# EAGLE schematic testv1 (EAGLE 6.3)
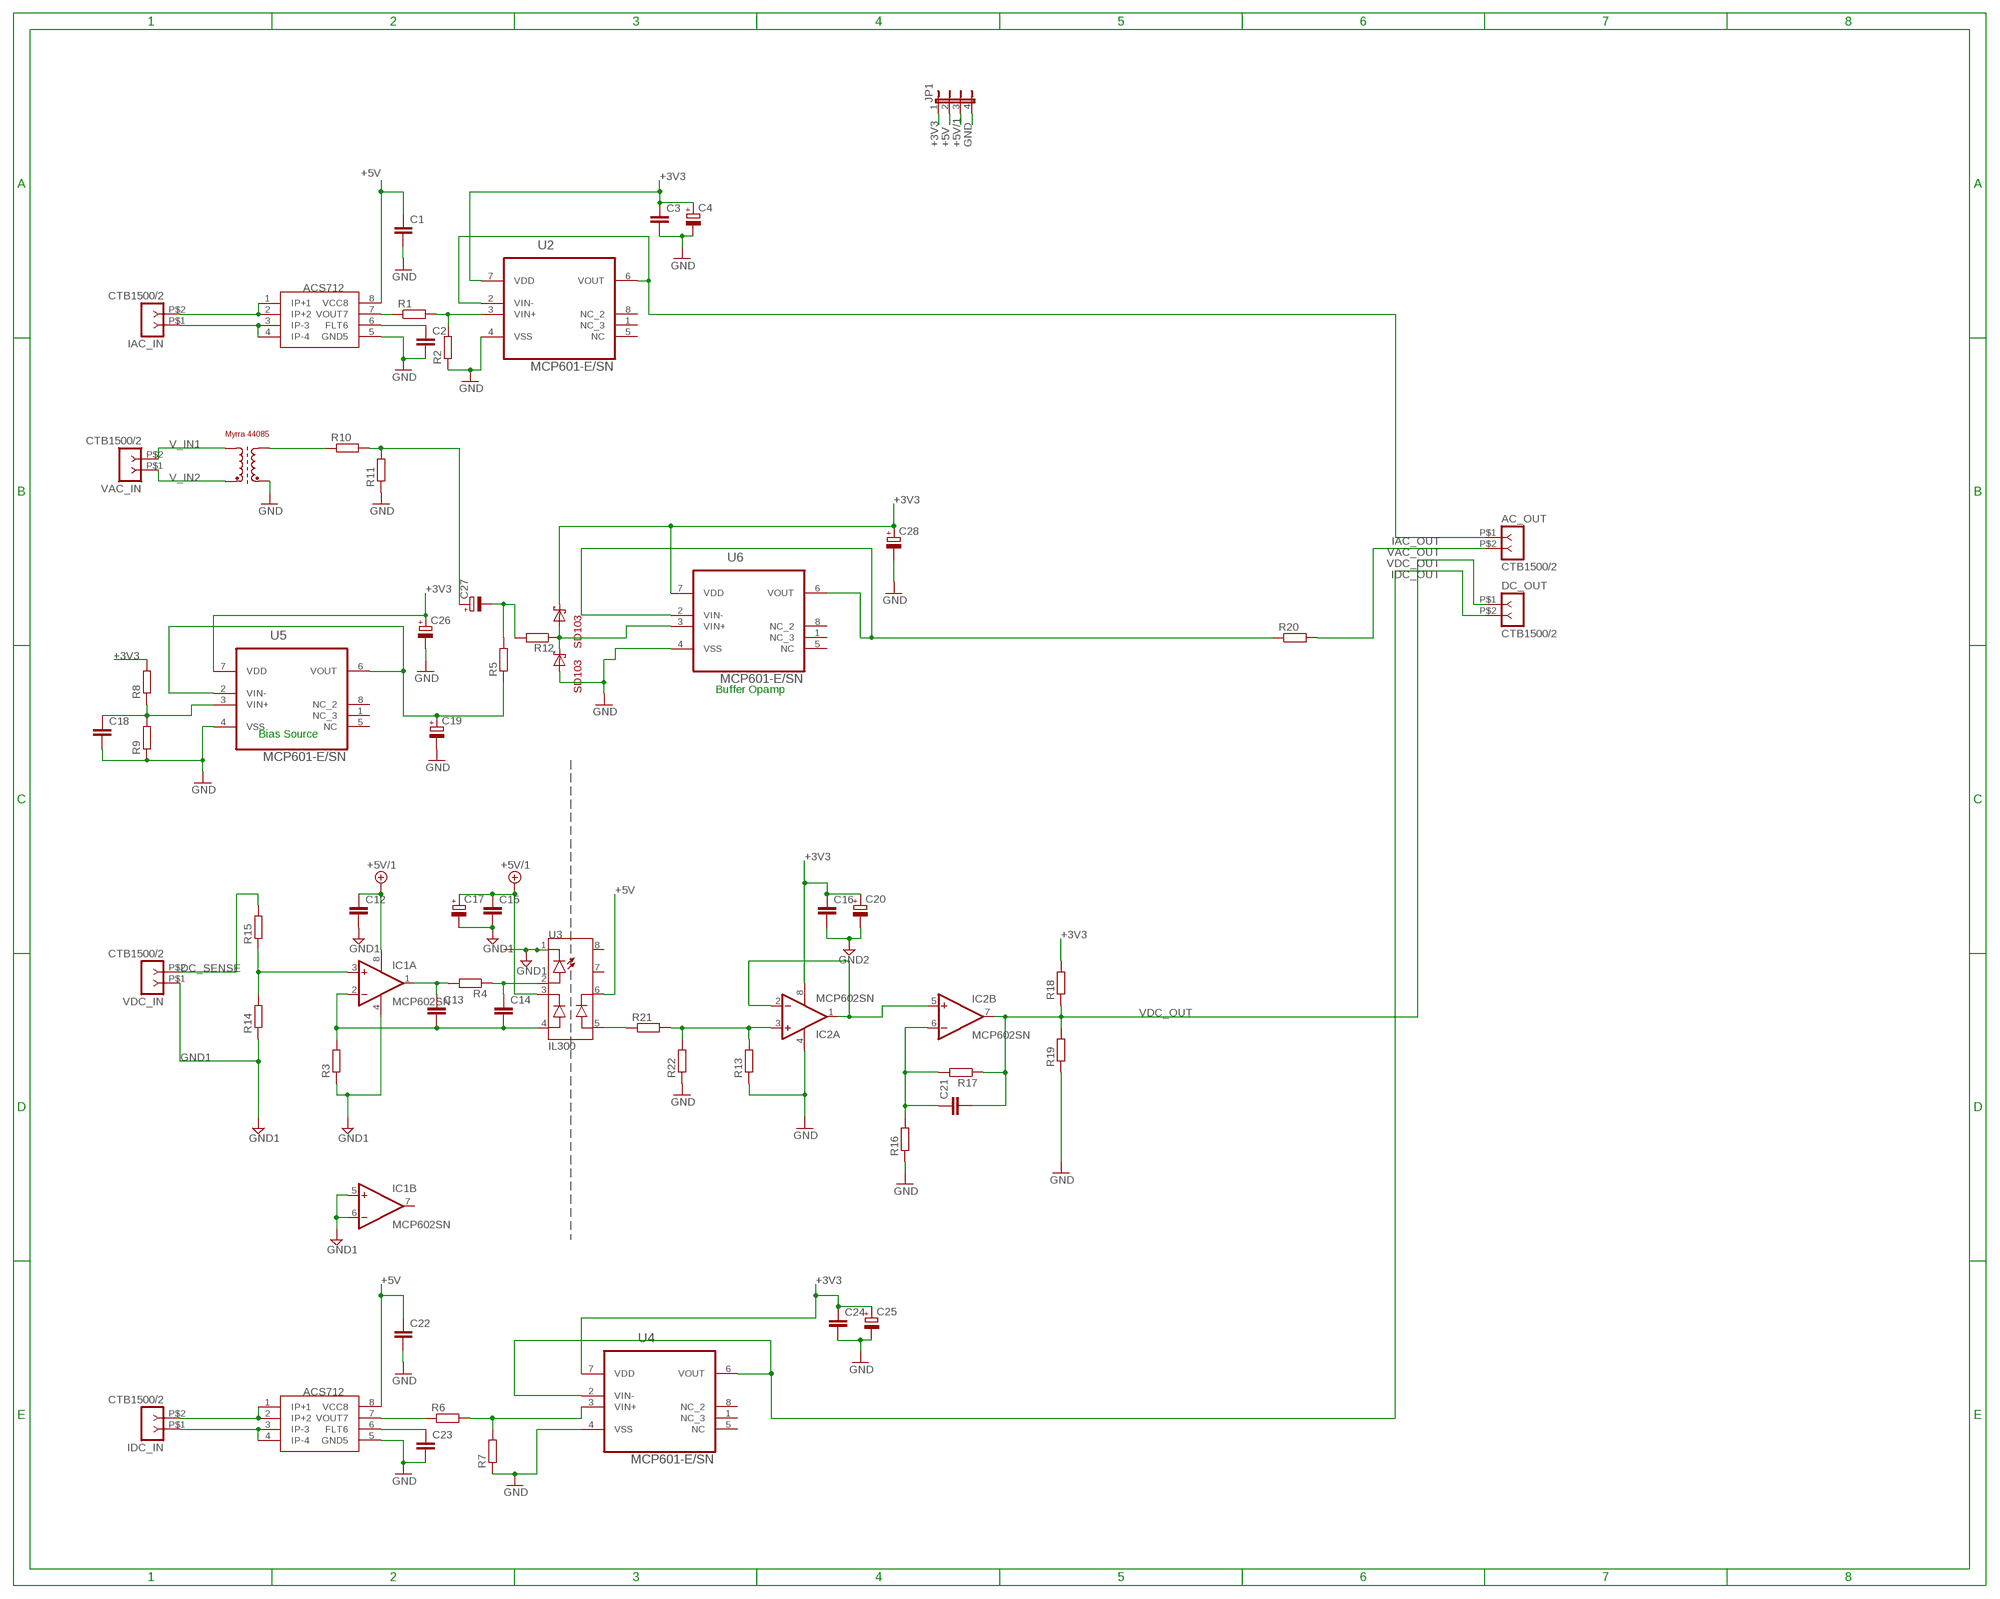
[diagram p0: schematic, sheet 1]

## Parts
AC_OUT  CTB1500/2  [CTB1500-2]
C1  C-EU025-025X050  [C025-025X050]
C2  C-EU025-025X050  [C025-025X050]
C3  C-EU025-025X050  [C025-025X050]
C4  CPOL-EUE2-4  [E2-4]
C12  C-EU025-025X050  [C025-025X050]
C13  C-EU025-025X050  [C025-025X050]
C14  C-EU025-025X050  [C025-025X050]
C15  C-EU025-025X050  [C025-025X050]
C16  C-EU025-025X050  [C025-025X050]
C17  CPOL-EUE2-4  [E2-4]
C18  C-EU025-025X050  [C025-025X050]
C19  CPOL-EUE2-4  [E2-4]
C20  CPOL-EUE2-4  [E2-4]
C21  C-EU025-025X050  [C025-025X050]
C22  C-EU025-025X050  [C025-025X050]
C23  C-EU025-025X050  [C025-025X050]
C24  C-EU025-025X050  [C025-025X050]
C25  CPOL-EUE2-4  [E2-4]
C26  CPOL-EUE2-4  [E2-4]
C27  CPOL-EUE2-4  [E2-4]
C28  CPOL-EUE2-4  [E2-4]
DC_OUT  CTB1500/2  [CTB1500-2]
IAC_IN  CTB1500/2  [CTB1500-2]
IC1  MCP602SN  [SO08]
IC2  MCP602SN  [SO08]
IDC_IN  CTB1500/2  [CTB1500-2]
JP1  JP4E  [JP4]
R1  R-EU_0207/7  [0207/7]
R2  R-EU_0207/7  [0207/7]
R3  R-EU_0207/7  [0207/7]
R4  R-EU_0207/7  [0207/7]
R5  R-EU_0207/7  [0207/7]
R6  R-EU_0207/7  [0207/7]
R7  R-EU_0207/7  [0207/7]
R8  R-EU_0207/7  [0207/7]
R9  R-EU_0207/7  [0207/7]
R10  R-EU_0207/7  [0207/7]
R11  R-EU_0207/7  [0207/7]
R12  R-EU_0207/7  [0207/7]
R13  R-EU_0207/7  [0207/7]
R14  R-EU_0207/7  [0207/7]
R15  R-EU_0207/7  [0207/7]
R16  R-EU_0207/7  [0207/7]
R17  R-EU_0207/7  [0207/7]
R18  R-EU_0207/7  [0207/7]
R19  R-EU_0207/7  [0207/7]
R20  R-EU_0207/7  [0207/7]
R21  R-EU_0207/7  [0207/7]
R22  R-EU_0207/7  [0207/7]
U2  MCP601-E/SN  [SOIC127P600X175-8N]
U3  IL300  [SO8]
U4  MCP601-E/SN  [SOIC127P600X175-8N]
U5  MCP601-E/SN  [SOIC127P600X175-8N]
U6  MCP601-E/SN  [SOIC127P600X175-8N]
U$1  ACS712  [SOIC8]
U$6  MYRRA_4408  [4408]
U$7  SD103A  [D035-10]
U$8  SD103A  [D035-10]
U$10  ACS712  [SOIC8]
VAC_IN  CTB1500/2  [CTB1500-2]
VDC_IN  CTB1500/2  [CTB1500-2]

## Nets
+3V3: C3.1 C4.+ C16.1 C20.+ C24.1 C25.+ C26.+ C28.+ IC2.8(P:V+) JP1.1 R8.2 R18.2 U2.7(VDD) U4.7(VDD) U5.7(VDD) U6.7(VDD) U$7.C
+5V: C1.1 C22.1 JP1.2 U3.6(C_OUT) U$1.8(VCC8) U$10.8(VCC8)
+5V/1: C12.1 C15.1 C17.+ IC1.8(P:V+) JP1.3 U3.3(C_FB)
DC_SENSE: R15.2 VDC_IN.P$2
GND: C1.2 C2.2 C3.2 C4.- C18.2 C19.- C22.2 C23.2 C24.2 C25.- C26.- C28.- IC2.4(P:V-) JP1.4 R2.1 R7.1 R9.1 R11.1 R13.1 R16.1 R19.1 R22.1 U2.4(VSS) U4.4(VSS) U5.4(VSS) U6.4(VSS) U$1.5(GND5) U$6.PIN9(E2) U$8.A U$10.5(GND5)
GND1: C12.2 C15.2 C17.- IC1.4(P:V-) IC1.5(B:+IN) IC1.6(B:-IN) R3.1 R14.1 U3.1(C_LED) VDC_IN.P$1
GND2: C16.2 C20.-
IAC_OUT: AC_OUT.P$1 U2.2(VIN-) U2.6(VOUT)
IDC_OUT: DC_OUT.P$2 U4.2(VIN-) U4.6(VOUT)
N$1: IAC_IN.P$2 U$1.1(IP+1) U$1.2(IP+2)
N$2: IAC_IN.P$1 U$1.3(IP-3) U$1.4(IP-4)
N$3: R1.1 U$1.7(VOUT7)
N$4: C2.1 U$1.6(FLT6)
N$5: C13.2 C14.2 IC1.2(A:-IN) R3.2 U3.4(A_FB)
N$6: R1.2 R2.2 U2.3(VIN+)
N$7: C14.1 R4.1 U3.2(A_LED)
N$8: IDC_IN.P$2 U$10.1(IP+1) U$10.2(IP+2)
N$9: C13.1 IC1.1(A:OUT) R4.2
N$10: C18.1 R8.1 R9.2 U5.3(VIN+)
N$11: C19.+ R5.1 U5.2(VIN-) U5.6(VOUT)
N$12: R12.1 U6.3(VIN+) U$7.A U$8.C
N$13: R20.1 U6.2(VIN-) U6.6(VOUT)
N$14: IC2.3(A:+IN) R13.2 R21.2 R22.2
N$15: R21.1 U3.5(A_OUT)
N$17: C27.+ R10.2 R11.2
N$18: R10.1 U$6.PIN7(A2)
N$20: IC2.1(A:OUT) IC2.2(A:-IN) IC2.5(B:+IN)
N$21: C27.- R5.2 R12.2
N$22: C21.1 IC2.6(B:-IN) R16.2 R17.2
N$25: IC1.3(A:+IN) R14.2 R15.1
N$26: IDC_IN.P$1 U$10.3(IP-3) U$10.4(IP-4)
N$27: R6.1 U$10.7(VOUT7)
N$28: C23.1 U$10.6(FLT6)
N$29: R6.2 R7.2 U4.3(VIN+)
V_IN1: U$6.PIN5(A1) VAC_IN.P$2
V_IN2: U$6.PIN1(E1) VAC_IN.P$1
VAC_OUT: AC_OUT.P$2 R20.2
VDC_OUT: C21.2 DC_OUT.P$1 IC2.7(B:OUT) R17.1 R18.1 R19.2
Unconnected: IC1.7(B:OUT) U2.1(NC_3) U2.5(NC) U2.8(NC_2) U3.7(PIN7) U3.8(PIN8) U4.1(NC_3) U4.5(NC) U4.8(NC_2) U5.1(NC_3) U5.5(NC) U5.8(NC_2) U6.1(NC_3) U6.5(NC) U6.8(NC_2)

## Notes on the sheet
- Buffer Opamp
- Bias Source

## Library data of the parts
AC_OUT DC_OUT IAC_IN IDC_IN VAC_IN VDC_IN = eko-parts:CTB1500/2
C1-C3 C12-C16 C18 C21-C24 = resistor:C-EU: CAPACITOR, European symbol
C4 C17 C19 C20 C25-C28 = resistor:CPOL-EU: POLARIZED CAPACITOR, European symbol
IC1 IC2 = linear:MCP602: Single Op Amp 2.7V to 6.0V Single Supply CMOS Source: http://ww1.microchip.com/downloads/en/DeviceDoc/21314g.pdf
JP1 = jumper:JP4E: JUMPER
R1-R22 = resistor:R-EU_: RESISTOR, European symbol
U2 U4-U6 = mcp:MCP601-E/SN: IC, 2.7V to 5.5V Single-Supply CMOS Single Op Amps,SOIC-8; MPN: MCP601-E/SN; OC_FARNELL: 1852039; OC_NEWARK: 88H9865; PACKAGE: SOIC-8; SUPPLIER: Microchip
U3 = eko-parts:IL300
U$1 U$10 = Pauls_parts:ACS712
U$6 = Pauls_parts:MYRRA_4408
U$7 U$8 = Pauls_parts:SD103A